# EAGLE design RoverWing-cover-V5 (EAGLE 9.2.2)
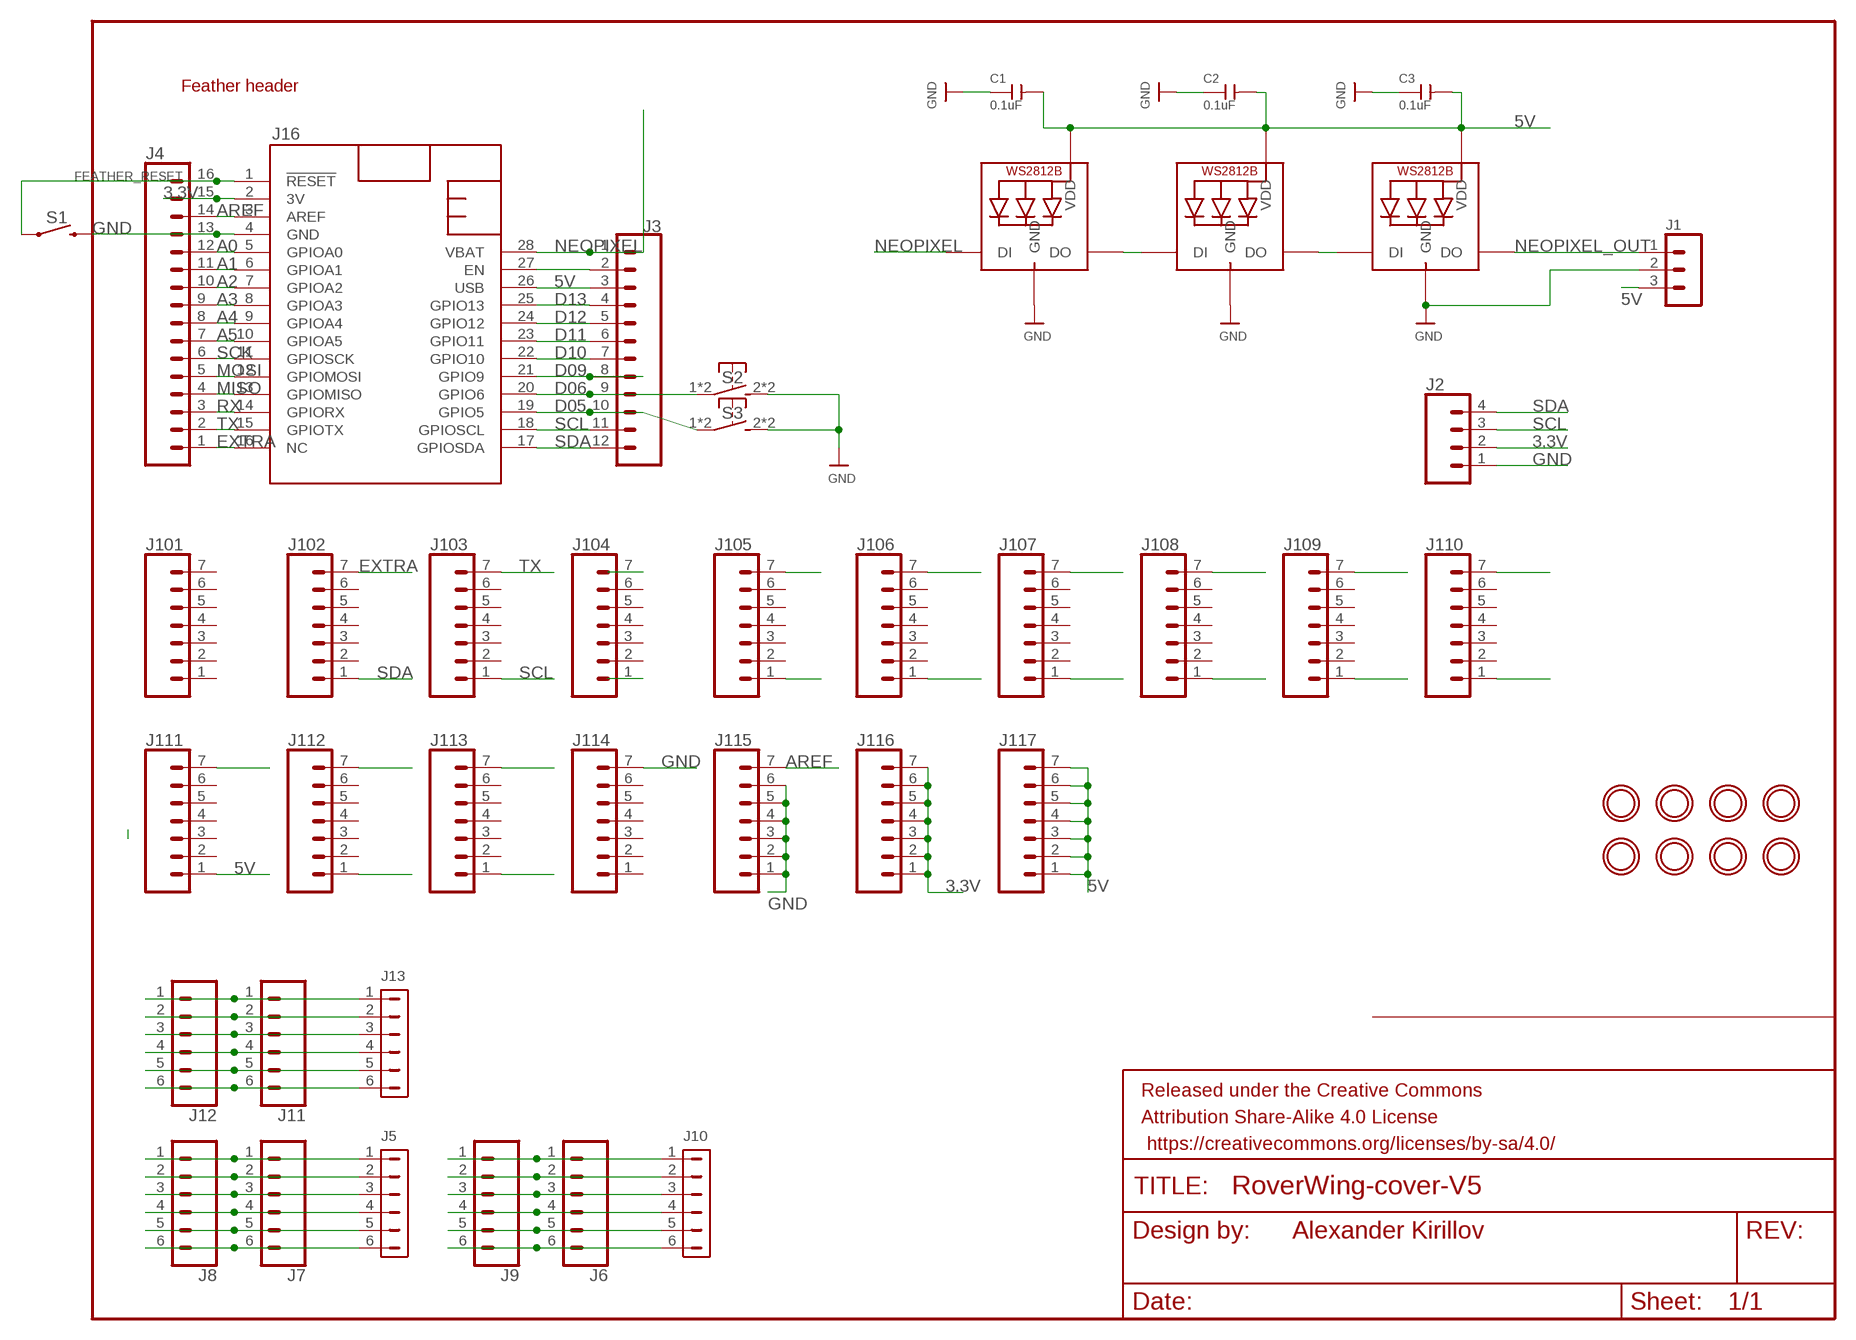
[diagram p0: schematic, sheet 1]

## Parts
C1  0.1uF  CAP-CERAMIC-SMD-0805  [C0805]
C2  0.1uF  CAP-CERAMIC-SMD-0805  [C0805]
C3  0.1uF  CAP-CERAMIC-SMD-0805  [C0805]
FRAME2  FRAME-LETTERNO_PACKAGE  [DUMMY]
J1  HEADER-PH-3PSIDEENTRY  [S3B-PH-K]
J2  CONN_04  [1X04]
J3  CONN_12NO_SILK  [1X12_NO_SILK]
J4  CONN_161X16_NO_SILK  [1X16_NO_SILK]
J5  HEADER-PH-6PSIDEENTRY  [S6B-PH-K]
J6  CONN_06NO_SILK_NO_POP  [1X06_NO_SILK]
J7  CONN_06NO_SILK_NO_POP  [1X06_NO_SILK]
J8  CONN_06NO_SILK_NO_POP  [1X06_NO_SILK]
J9  CONN_06NO_SILK_NO_POP  [1X06_NO_SILK]
J10  HEADER-PH-6PSIDEENTRY  [S6B-PH-K]
J11  CONN_06NO_SILK_NO_POP  [1X06_NO_SILK]
J12  CONN_06NO_SILK_NO_POP  [1X06_NO_SILK]
J13  HEADER-PH-6PSIDEENTRY  [S6B-PH-K]
J16  FEATHERWING_NODIM  [FEATHERWING_DIM]
J101  CONN_07NO_SILK  [1X07_NO_SILK]
J102  CONN_07NO_SILK  [1X07_NO_SILK]
J103  CONN_07NO_SILK  [1X07_NO_SILK]
J104  CONN_07NO_SILK  [1X07_NO_SILK]
J105  CONN_07NO_SILK  [1X07_NO_SILK]
J106  CONN_07NO_SILK  [1X07_NO_SILK]
J107  CONN_07NO_SILK  [1X07_NO_SILK]
J108  CONN_07NO_SILK  [1X07_NO_SILK]
J109  CONN_07NO_SILK  [1X07_NO_SILK]
J110  CONN_07NO_SILK  [1X07_NO_SILK]
J111  CONN_07NO_SILK  [1X07_NO_SILK]
J112  CONN_07NO_SILK  [1X07_NO_SILK]
J113  CONN_07NO_SILK  [1X07_NO_SILK]
J114  CONN_07NO_SILK  [1X07_NO_SILK]
J115  CONN_07NO_SILK  [1X07_NO_SILK]
J116  CONN_07NO_SILK  [1X07_NO_SILK]
J117  CONN_07NO_SILK  [1X07_NO_SILK]
LED1  WS2812B5050  [WS2812B]
LED2  WS2812B5050  [WS2812B]
LED3  WS2812B5050  [WS2812B]
S1  MOMENTARY-SWITCH-SPST-PTH-6.0MM  [TACTILE_SWITCH_PTH_6.0MM]
S2  SW-TACTILE-4.5X4.5_SMD  [TL3305]
S3  SW-TACTILE-4.5X4.5_SMD  [TL3305]
U$3  MOUNTINGHOLE3.0_NPH  [MOUNTINGHOLE_3.0_NPH]
U$4  MOUNTINGHOLE3.0_NPH  [MOUNTINGHOLE_3.0_NPH]
U$14  MOUNTINGHOLE3.0_NPH  [MOUNTINGHOLE_3.0_NPH]
U$15  MOUNTINGHOLE3.0_NPH  [MOUNTINGHOLE_3.0_NPH]
U$24  MOUNTINGHOLE3.0_NPH  [MOUNTINGHOLE_3.0_NPH]
U$25  MOUNTINGHOLE3.0_NPH  [MOUNTINGHOLE_3.0_NPH]
U$26  MOUNTINGHOLE3.0_NPH  [MOUNTINGHOLE_3.0_NPH]
U$27  MOUNTINGHOLE3.0_NPH  [MOUNTINGHOLE_3.0_NPH]

## Nets
3.3V: J2.2 J4.15 J16.2(3V) J116.1 J116.2 J116.3 J116.4 J116.5 J116.6 J116.7
5V: C1.2 C2.2 C3.2 J1.3 J3.3 J16.26(USB) J111.1 J117.1 J117.2 J117.3 J117.4 J117.5 J117.6 J117.7 LED1.1-VDD(VDD) LED2.1-VDD(VDD) LED3.1-VDD(VDD)
A0: J4.12 J16.5(GPIOA0) J113.7
A1: J4.11 J16.6(GPIOA1) J112.7
A2: J4.10 J16.7(GPIOA2) J111.7
A3: J4.9 J16.8(GPIOA3) J110.7
A4: J4.8 J16.9(GPIOA4) J109.7
A5: J4.7 J16.10(GPIOA5) J108.7
AREF: J4.14 J16.3(AREF) J115.7
D05: J3.10 J16.19(GPIO5) J104.1 S3.1 S3.4(P1)
D06: J3.9 J16.20(GPIO6) J105.1 S2.1 S2.4(P1)
D09: J3.8 J16.21(GPIO9) J106.1
D10: J3.7 J16.22(GPIO10) J107.1
D11: J3.6 J16.23(GPIO11) J108.1
D12: J3.5 J16.24(GPIO12) J109.1
D13: J3.4 J16.25(GPIO13) J110.1
EXTRA: J4.1 J16.16(NC) J102.7
FEATHER_RESET: J4.16 J16.1(!RESET) S1.1
GND: C1.1 C2.1 C3.1 J1.2 J2.1 J4.13 J16.4(GND) J114.7 J115.1 J115.2 J115.3 J115.4 J115.5 J115.6 LED1.3-GND(GND) LED2.3-GND(GND) LED3.3-GND(GND) S1.3 S2.2(S1) S2.3(S1) S3.2(S1) S3.3(S1)
MISO: J4.4 J16.13(GPIOMISO) J105.7
MOSI: J4.5 J16.12(GPIOMOSI) J106.7
N$1: LED2.2-DOUT(DO) LED3.4-DIN(DI)
N$2: J5.1 J7.1 J8.1
N$3: LED1.2-DOUT(DO) LED2.4-DIN(DI)
N$4: J5.2 J7.2 J8.2
N$5: J5.3 J7.3 J8.3
N$6: J113.1
N$7: J5.4 J7.4 J8.4
N$8: J5.5 J7.5 J8.5
N$9: J5.6 J7.6 J8.6
N$10: J6.1 J9.1 J10.1
N$11: J6.2 J9.2 J10.2
N$12: J6.3 J9.3 J10.3
N$13: J6.4 J9.4 J10.4
N$14: J6.5 J9.5 J10.5
N$15: J6.6 J9.6 J10.6
N$16: J11.1 J12.1 J13.1
N$17: J11.2 J12.2 J13.2
N$18: J11.3 J12.3 J13.3
N$19: J11.4 J12.4 J13.4
N$20: J11.5 J12.5 J13.5
N$21: J11.6 J12.6 J13.6
N$37: J3.2 J16.27(EN) J112.1
NEOPIXEL: J3.1 J16.28(VBAT) LED1.4-DIN(DI)
NEOPIXEL_OUT: J1.1 LED3.2-DOUT(DO)
RX: J4.3 J16.14(GPIORX) J104.7
SCK: J4.6 J16.11(GPIOSCK) J107.7
SCL: J2.3 J3.11 J16.18(GPIOSCL) J103.1
SDA: J2.4 J3.12 J16.17(GPIOSDA) J102.1
TX: J4.2 J16.15(GPIOTX) J103.7
Unconnected: J101.1 J101.2 J101.3 J101.4 J101.5 J101.6 J101.7 J102.2 J102.3 J102.4 J102.5 J102.6 J103.2 J103.3 J103.4 J103.5 J103.6 J104.2 J104.3 J104.4 J104.5 J104.6 J105.2 J105.3 J105.4 J105.5 J105.6 J106.2 J106.3 J106.4 J106.5 J106.6 J107.2 J107.3 J107.4 J107.5 J107.6 J108.2 J108.3 J108.4 J108.5 J108.6 J109.2 J109.3 J109.4 J109.5 J109.6 J110.2 J110.3 J110.4 J110.5 J110.6 J111.2 J111.3 J111.4 J111.5 J111.6 J112.2 J112.3 J112.4 J112.5 J112.6 J113.2 J113.3 J113.4 J113.5 J113.6 J114.1 J114.2 J114.3 J114.4 J114.5 J114.6

## Notes on the sheet
- Feather header
- Alexander Kirillov

## Library data of the parts
C1-C3 = RoverWing:CAP-CERAMIC-SMD-0805
FRAME2 = SparkFun-Aesthetics:FRAME-LETTER: Schematic Frame - Letter Standard 8.5x11 US Letter frame; DESIGNER: Nobody; VERSION: v01
J1 = RoverWing:HEADER-PH-3P: HEADER; PARTNO: S3B-PH-K-S(LF)(SN)
J2 = SparkFun-Connectors:CONN_04: Multi connection point. Often used as Generic Header-pin footprint for 0.1 inch spaced/style header connections On any of the 0.1 inch spaced packages, you can populate with these: Break Away Headers - Straight <https://www.sparkfun.com/products/116> (PRT-00116) Break Away Male Headers - Right Angle <https://www.sparkfun.com/products/553> (PRT-00553) Female Headers <https://www.sparkfun.com/products/115> (PRT-00115) Break Away Headers - Machine Pin <https://www.sparkfun.com/products/117> (PRT-00117) Break Away Female Headers - Swiss Machine Pin <https://www.sparkfun.com/products/743> (PRT-00743) For SCREWTERMINALS and SPRING TERMINALS visit here: Screw Terimnals on SparkFun.com <https://www.sparkfun.com/search/results?term=Screw+Terminals> (5mm/3.5mm/2.54mm spacing) This device is also useful as a general connection point to wire up your design to another part of your project. Our various solder wires solder well into these plated through hole pads. Hook-Up Wire - Assortment (Stranded, 22 AWG) <https://www.sparkfun.com/products/11375> (PRT-11375) Hook-Up Wire - Assortment (Solid Core, 22 AWG) <https://www.sparkfun.com/products/11367> (PRT-11367) View the entire wire category on our website here <https://www.sparkfun.com/categories/141> Special notes: Molex polarized connector foot print use with SKU : PRT-08231 with associated crimp pins and housings. 1MM SMD Version SKU: PRT-10208; PROD_ID: CONN-09696
J3 = SparkFun-Connectors:CONN_12: Multi connection point. Often used as Generic Header-pin footprint for 0.1 inch spaced/style header connections On any of the 0.1 inch spaced packages, you can populate with these: Break Away Headers - Straight <https://www.sparkfun.com/products/116> (PRT-00116) Break Away Male Headers - Right Angle <https://www.sparkfun.com/products/553> (PRT-00553) Female Headers <https://www.sparkfun.com/products/115> (PRT-00115) Break Away Headers - Machine Pin <https://www.sparkfun.com/products/117> (PRT-00117) Break Away Female Headers - Swiss Machine Pin <https://www.sparkfun.com/products/743> (PRT-00743) For SCREWTERMINALS and SPRING TERMINALS visit here: Screw Terimnals on SparkFun.com <https://www.sparkfun.com/search/results?term=Screw+Terminals> (5mm/3.5mm/2.54mm spacing) This device is also useful as a general connection point to wire up your design to another part of your project. Our various solder wires solder well into these plated through hole pads. Hook-Up Wire - Assortment (Stranded, 22 AWG) <https://www.sparkfun.com/products/11375> (PRT-11375) Hook-Up Wire - Assortment (Solid Core, 22 AWG) <https://www.sparkfun.com/products/11367> (PRT-11367) View the entire wire category on our website here <https://www.sparkfun.com/categories/141> Special notes: Molex polarized connector foot print use with SKU : PRT-08231 with associated crimp pins and housings. 1MM SMD Version SKU: PRT-10208 NOTES ON THE VARIANTS LOCK and LOCK_LONGPADS... This footprint was designed to help hold the alignment of a through-hole component (i.e. 6-pin header) while soldering it into place. You may notice that each hole has been shifted either up or down by 0.005 of an inch from it's more standard position (which is a perfectly straight line). This slight alteration caused the pins (the squares in the middle) to touch the edges of the holes. Because they are alternating, it causes a "brace" to hold the component in place. 0.005 has proven to be the perfect amount of "off-center" position when using our standard breakaway headers. Although looks a little odd when you look at the bare footprint, once you have a header in there, the alteration is very hard to notice. Also,if you push a header all the way into place, it is covered up entirely on the bottom side.
J4 = SparkFun-Connectors:CONN_16: Multi connection point. Often used as Generic Header-pin footprint for 0.1 inch spaced/style header connections On any of the 0.1 inch spaced packages, you can populate with these: Break Away Headers - Straight <https://www.sparkfun.com/products/116> (PRT-00116) Break Away Male Headers - Right Angle <https://www.sparkfun.com/products/553> (PRT-00553) Female Headers <https://www.sparkfun.com/products/115> (PRT-00115) Break Away Headers - Machine Pin <https://www.sparkfun.com/products/117> (PRT-00117) Break Away Female Headers - Swiss Machine Pin <https://www.sparkfun.com/products/743> (PRT-00743) For SCREWTERMINALS and SPRING TERMINALS visit here: Screw Terimnals on SparkFun.com <https://www.sparkfun.com/search/results?term=Screw+Terminals> (5mm/3.5mm/2.54mm spacing) This device is also useful as a general connection point to wire up your design to another part of your project. Our various solder wires solder well into these plated through hole pads. Hook-Up Wire - Assortment (Stranded, 22 AWG) <https://www.sparkfun.com/products/11375> (PRT-11375) Hook-Up Wire - Assortment (Solid Core, 22 AWG) <https://www.sparkfun.com/products/11367> (PRT-11367) View the entire wire category on our website here <https://www.sparkfun.com/categories/141> Special notes: Molex polarized connector foot print use with SKU : PRT-08231 with associated crimp pins and housings. 1MM SMD Version SKU: PRT-10208 NOTES ON THE VARIANTS LOCK and LOCK_LONGPADS... This footprint was designed to help hold the alignment of a through-hole component (i.e. 6-pin header) while soldering it into place. You may notice that each hole has been shifted either up or down by 0.005 of an inch from it's more standard position (which is a perfectly straight line). This slight alteration caused the pins (the squares in the middle) to touch the edges of the holes. Because they are alternating, it causes a "brace" to hold the component in place. 0.005 has proven to be the perfect amount of "off-center" position when using our standard breakaway headers. Although looks a little odd when you look at the bare footprint, once you have a header in there, the alteration is very hard to notice. Also,if you push a header all the way into place, it is covered up entirely on the bottom side.
J5 J10 J13 = RoverWing:HEADER-PH-6P: JST PH header, 6 pos
J6-J9 J11 J12 = SparkFun-Connectors:CONN_06: Multi connection point. Often used as Generic Header-pin footprint for 0.1 inch spaced/style header connections On any of the 0.1 inch spaced packages, you can populate with these: Break Away Headers - Straight <https://www.sparkfun.com/products/116> (PRT-00116) Break Away Male Headers - Right Angle <https://www.sparkfun.com/products/553> (PRT-00553) Female Headers <https://www.sparkfun.com/products/115> (PRT-00115) Break Away Headers - Machine Pin <https://www.sparkfun.com/products/117> (PRT-00117) Break Away Female Headers - Swiss Machine Pin <https://www.sparkfun.com/products/743> (PRT-00743) Arduino Stackable Header - 6 Pin <https://www.sparkfun.com/products/9280> (PRT-09280) For SCREWTERMINALS and SPRING TERMINALS visit here: Screw Terimnals on SparkFun.com <https://www.sparkfun.com/search/results?term=Screw+Terminals> (5mm/3.5mm/2.54mm spacing) This device is also useful as a general connection point to wire up your design to another part of your project. Our various solder wires solder well into these plated through hole pads. Hook-Up Wire - Assortment (Stranded, 22 AWG) <https://www.sparkfun.com/products/11375> (PRT-11375) Hook-Up Wire - Assortment (Solid Core, 22 AWG) <https://www.sparkfun.com/products/11367> (PRT-11367) View the entire wire category on our website here <https://www.sparkfun.com/categories/141>
J16 = RoverShield:FEATHERWING: Adafruit Feather
J101-J117 = SparkFun-Connectors:CONN_07: Multi connection point. Often used as Generic Header-pin footprint for 0.1 inch spaced/style header connections On any of the 0.1 inch spaced packages, you can populate with these: Break Away Headers - Straight <https://www.sparkfun.com/products/116> (PRT-00116) Break Away Male Headers - Right Angle <https://www.sparkfun.com/products/553> (PRT-00553) Female Headers <https://www.sparkfun.com/products/115> (PRT-00115) Break Away Headers - Machine Pin <https://www.sparkfun.com/products/117> (PRT-00117) Break Away Female Headers - Swiss Machine Pin <https://www.sparkfun.com/products/743> (PRT-00743) For SCREWTERMINALS and SPRING TERMINALS visit here: Screw Terimnals on SparkFun.com <https://www.sparkfun.com/search/results?term=Screw+Terminals> (5mm/3.5mm/2.54mm spacing) This device is also useful as a general connection point to wire up your design to another part of your project. Our various solder wires solder well into these plated through hole pads. Hook-Up Wire - Assortment (Stranded, 22 AWG) <https://www.sparkfun.com/products/11375> (PRT-11375) Hook-Up Wire - Assortment (Solid Core, 22 AWG) <https://www.sparkfun.com/products/11367> (PRT-11367) View the entire wire category on our website here <https://www.sparkfun.com/categories/141> Special notes: Molex polarized connector foot print use with SKU : PRT-08231 with associated crimp pins and housings. 1MM SMD Version SKU: PRT-10208 NOTES ON THE VARIANTS LOCK and LOCK_LONGPADS... This footprint was designed to help hold the alignment of a through-hole component (i.e. 6-pin header) while soldering it into place. You may notice that each hole has been shifted either up or down by 0.005 of an inch from it's more standard position (which is a perfectly straight line). This slight alteration caused the pins (the squares in the middle) to touch the edges of the holes. Because they are alternating, it causes a "brace" to hold the component in place. 0.005 has proven to be the perfect amount of "off-center" position when using our standard breakaway headers. Although looks a little odd when you look at the bare footprint, once you have a header in there, the alteration is very hard to notice. Also,if you push a header all the way into place, it is covered up entirely on the bottom side.
LED1-LED3 = adafruit:WS2812B
S1 = SparkFun-Switches:MOMENTARY-SWITCH-SPST: Momentary Switch (Pushbutton) - SPST Normally-open (NO) SPST momentary switches (buttons, pushbuttons). Variants PTH-12MM - 12mm square, through-hole Momentary Pushbutton Switch - 12mm Square <https://www.sparkfun.com/products/9190> (COM-09190) PTH-6.0MM, PTH-6.0MM-KIT - 6.0mm square, through-hole Mini Pushbutton Switch <https://www.sparkfun.com/products/97> (COM-00097) KIT package intended for soldering kit's - only one side of pads' copper is exposed. PTH-RIGHT-ANGLE-KIT - Right-angle, through-hole Right Angle Tactile Button <https://www.sparkfun.com/products/10791> - Used on SparkFun BigTime Watch Kit <https://www.sparkfun.com/products/11734> SMD-12MM - 12mm square, surface-mount Tactile Button - SMD (12mm) <https://www.sparkfun.com/products/12993> (COM-12993) Used on SparkFun PicoBoard <https://www.sparkfun.com/products/11888> SMD-4.5MM - 4.5mm Square Trackball Switch Used on SparkFun Blackberry Trackballer Breakout <https://www.sparkfun.com/products/13169> SMD-4.6MMX2.8MM - 4.60mm x 2.80mm, surface mount Used on SparkFun SAMD21 Mini Breakout <https://www.sparkfun.com/products/13664> SMD-5.2MM, SMD-5.2-REDUNDANT - 5.2mm square, surface-mount Mini Pushbutton Switch - SMD <https://www.sparkfun.com/products/8720> (COM-08720) Used on Arduino Pro Mini <https://www.sparkfun.com/products/11114> REDUNDANT package connects both switch circuits together SMD-6.0X3.5MM - 6.0 x 3.5mm, surface mount Momentary Reset Switch SMD <https://www.sparkfun.com/products/8229> (COM-08229) SMD-6.2MM-TALL - 6.2mm square, surface mount Tactile Button - SMD (6mm) <https://www.sparkfun.com/products/12992> Used on SparkFun Digital Sandbox <https://www.sparkfun.com/products/12651> SMD-RIGHT-ANGLE - Right-angle, surface mount Used on SparkFun Block for Intel® Edison - Arduino <https://www.sparkfun.com/products/13036>; PROD_ID: SWCH-08441; SF_SKU: COM-00097
S2 S3 = RoverWing:SW-TACTILE: Tactile Switche
U$3 U$4 U$14 U$15 U$24-U$27 = CrickitCopy:MOUNTINGHOLE: Mounting Hole For #2 screws (0.086"/2.18mm width, 0.094"/2.4mm hole) use 2.5mm

## Net classes
1 thinpower: width 0.305 mm
2 thickpower: width 0.406 mm

## Board
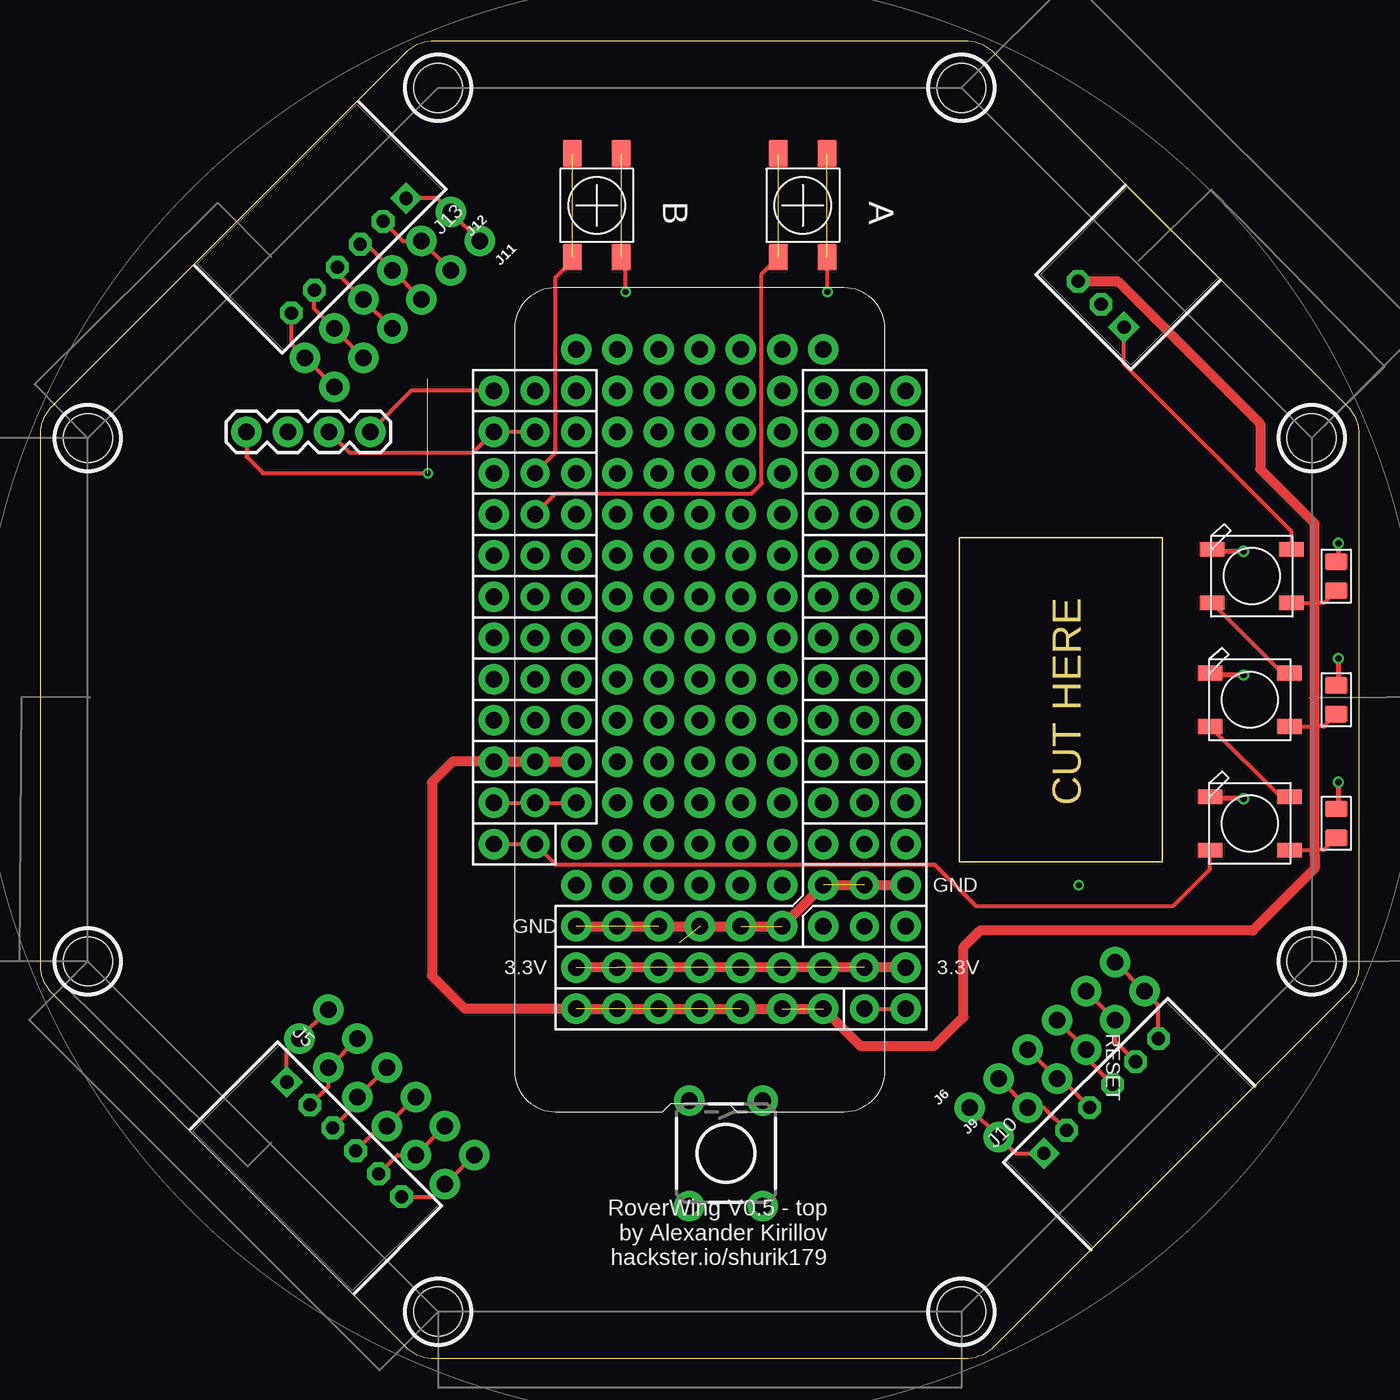
[diagram p1: board, top side]
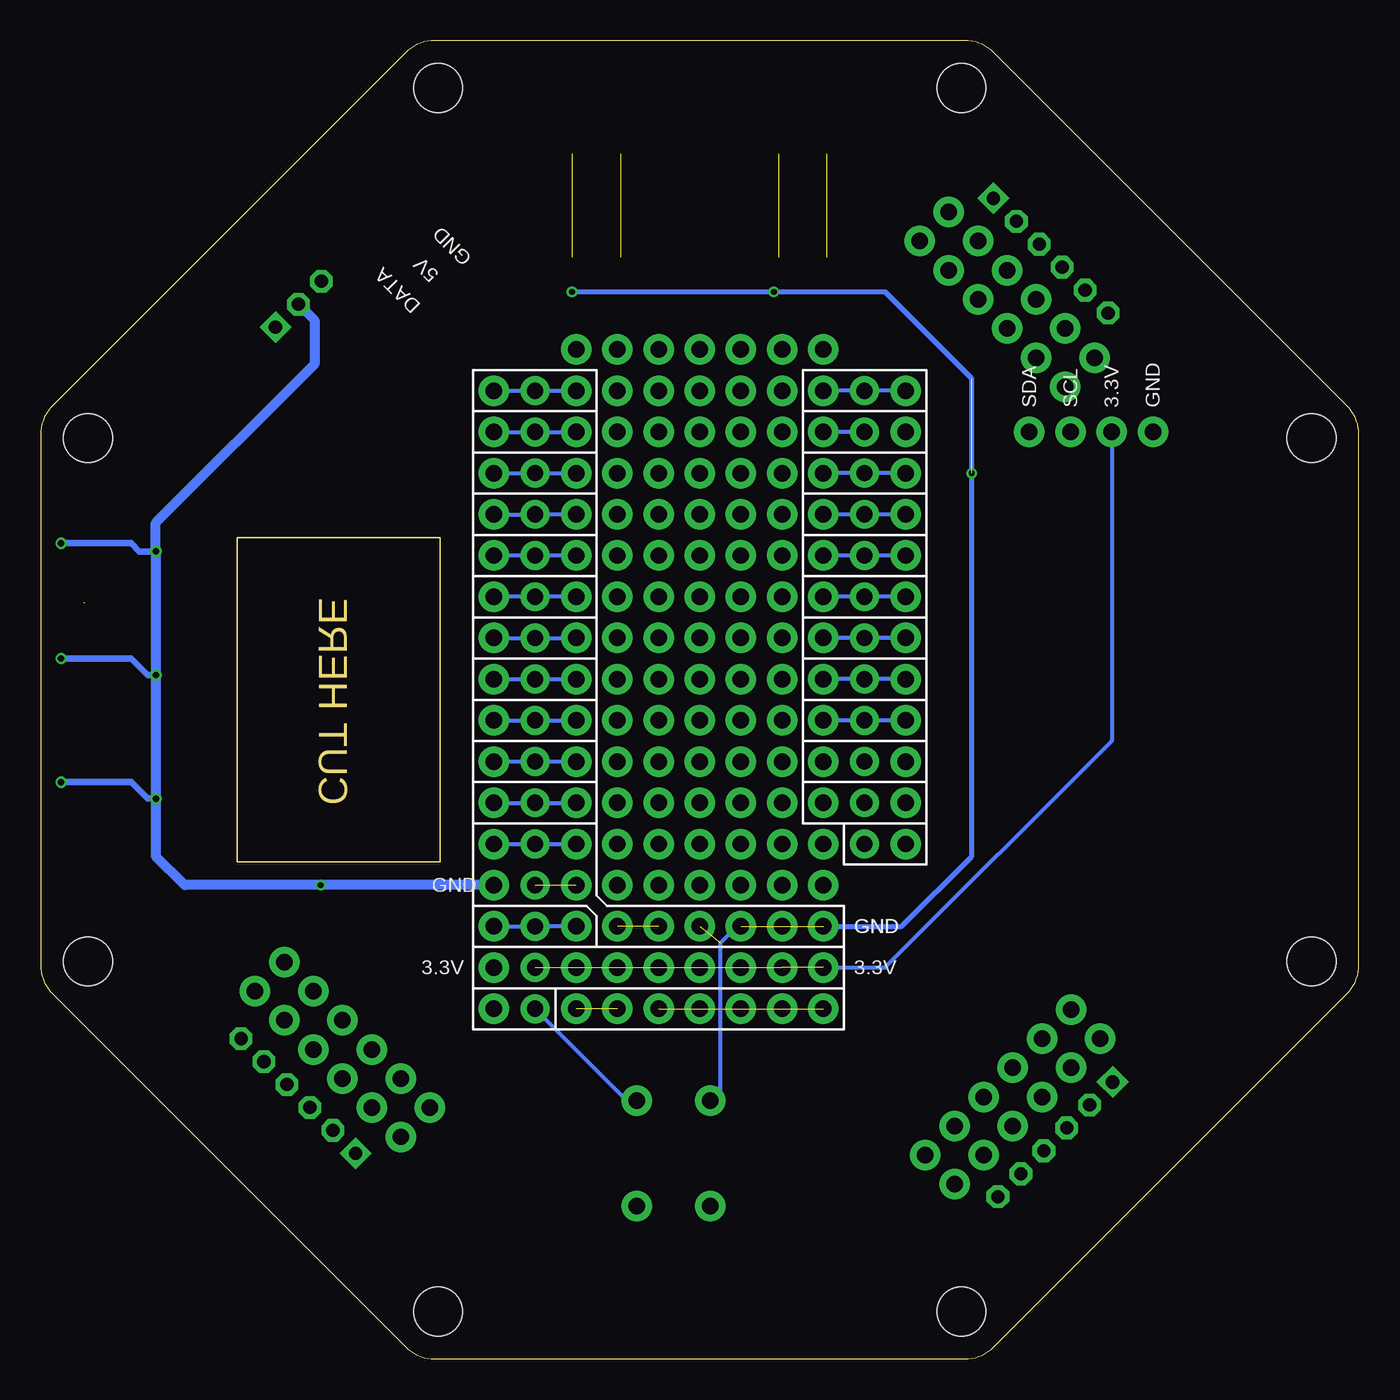
[diagram p2: board, bottom side, seen from below]

Size 81.28 x 81.28 mm. Coordinates in mm from the lower left corner, seen from the top.
Outline: 0,24.29 0,56.99 arc-45 0.74,58.78 22.5,80.54 arc-45 24.29,81.28 56.99,81.28 arc-45 58.78,80.54 80.54,58.78 arc-45 81.28,56.99 81.28,24.29 arc-45 80.54,22.5 58.78,0.74 arc-45 56.99,0 24.29,0 arc-45 22.5,0.74 0.74,22.5 arc-45 0,24.29
Outline: 56.65,50.64 69.15,50.64 69.15,30.64 56.65,30.64 56.65,50.64
Copper layers (1*16): Top 0.035mm / dielectric 1.5mm / Bottom 0.035mm
Design rules "SeeedStudio_2layer_DRU_no_angle_20140221": minimum track width 6mil, minimum drill 12mil, track to track 6mil, track to pad 6mil, pad to pad 6mil, via to via 6mil, smd to smd 0mil, copper to edge 10mil, drill to drill 10mil, minimum pad ring 10mil, minimum via ring 6mil, stop-mask expansion 2mil, vias tented up to drill 100mil, thermal gap 10mil

### Footprints (pad centres in the part's own frame; a part is rotated, then mirrored left to right if it is on the bottom)
C0805 = smd 1.397 x 1.016: 1 0,0.889; 2 0,-0.889
S3B-PH-K = drill 0.813 pad 1.397 square: 1 2,0 | drill 0.813 pad 1.397 octagon: 2 0,0; 3 -2,0
1X04 = drill 1.016 pad 1.88: 1 0,0; 2 2.54,0; 3 5.08,0; 4 7.62,0
1X12_NO_SILK = drill 1.016 pad 1.88: 1 0,0; 2 2.54,0; 3 5.08,0; 4 7.62,0; 5 10.16,0; 6 12.7,0; 7 15.24,0; 8 17.78,0; 9 20.32,0; 10 22.86,0; 11 25.4,0; 12 27.94,0
1X16_NO_SILK = drill 1.016 pad 1.88: 1 0,0; 2 2.54,0; 3 5.08,0; 4 7.62,0; 5 10.16,0; 6 12.7,0; 7 15.24,0; 8 17.78,0; 9 20.32,0; 10 22.86,0; 11 25.4,0; 12 27.94,0; 13 30.48,0; 14 33.02,0; 15 35.56,0; 16 38.1,0
S6B-PH-K = drill 0.813 pad 1.397 square: 1 5,0 | drill 0.813 pad 1.397 octagon: 2 3,0; 3 1,0; 4 -1,0; 5 -3,0; 6 -5,0
1X06_NO_SILK = drill 1.016 pad 1.88: 1 0,0; 2 2.54,0; 3 5.08,0; 4 7.62,0; 5 10.16,0; 6 12.7,0
FEATHERWING_DIM = drill 1 pad 1.778: 1 6.35,1.27; 2 8.89,1.27; 3 11.43,1.27; 4 13.97,1.27; 5 16.51,1.27; 6 19.05,1.27; 7 21.59,1.27; 8 24.13,1.27; 9 26.67,1.27; 10 29.21,1.27; 11 31.75,1.27; 12 34.29,1.27; 13 36.83,1.27; 14 39.37,1.27; 15 41.91,1.27; 16 44.45,1.27; 17 44.45,21.59; 18 41.91,21.59; 19 39.37,21.59; 20 36.83,21.59; 21 34.29,21.59; 22 31.75,21.59; 23 29.21,21.59; 24 26.67,21.59; 25 24.13,21.59; 26 21.59,21.59; 27 19.05,21.59; 28 16.51,21.59
1X07_NO_SILK = drill 1.016 pad 1.88: 1 0,0; 2 2.54,0; 3 5.08,0; 4 7.62,0; 5 10.16,0; 6 12.7,0; 7 15.24,0
WS2812B = smd 1.5 x 0.9: 1-VDD 2.45,-1.65; 2-DOUT 2.45,1.65; 3-GND -2.45,1.65; 4-DIN -2.45,-1.65
TACTILE_SWITCH_PTH_6.0MM = drill 1.016 pad 1.88: 1 -3.251,2.261; 2 3.251,2.261; 3 -3.251,-2.261; 4 3.251,-2.261
TL3305 = smd 1.6 x 1.2: 1 -3.2,1.5; 2 -3.2,-1.5; 3 3.2,-1.5; 4 3.2,1.5
MOUNTINGHOLE_3.0_NPH = hole 3: 0,0

### Placement (x,y rotation side)
C1  79.88,33.02 0 top
C2  79.88,40.64 0 top
C3  79.88,48.26 0 top
FRAME2  77.85,82.17 0 top
J1  65.38,65.02 315 top
J2  12.7,57.15 0 top
J3  27.94,31.75 90 top
J4  53.34,59.69 270 top
J5  18.72,13.54 135 top
J6  57.28,15.49 45 top
J7  17.75,21.54 315 top
J8  15.95,19.75 315 top
J9  59.07,13.69 45 top
J10  65.38,16.21 225 top
J11  27.08,68.91 225 top
J12  25.29,70.71 225 top
J13  19,68.02 45 top
J16  52.07,15.24 90 top
J101  33.02,62.23 0 top
J102  33.02,59.69 0 top
J103  33.02,57.15 0 top
J104  33.02,54.61 0 top
J105  33.02,52.07 0 top
J106  33.02,49.53 0 top
J107  33.02,46.99 0 top
J108  33.02,44.45 0 top
J109  33.02,41.91 0 top
J110  33.02,39.37 0 top
J111  33.02,36.83 0 top
J112  33.02,34.29 0 top
J113  33.02,31.75 0 top
J114  33.02,29.21 0 top
J115  33.02,26.67 0 top
J116  33.02,24.13 0 top
J117  33.02,21.59 0 top
LED1  74.55,33.02 0 top
LED2  74.55,40.64 0 top
LED3  74.68,48.26 0 top
S1  42.25,12.69 270 top
S2  46.99,71.12 90 top
S3  34.29,71.12 90 top
U$3  24.51,2.92 0 top
U$4  56.77,2.92 0 top
U$14  2.92,24.51 0 top
U$15  2.92,56.77 0 top
U$24  78.36,24.51 0 top
U$25  78.36,56.77 0 top
U$26  24.51,78.36 0 top
U$27  56.77,78.36 0 top

### Tracks (layer width: path | path; a pad name or v marks a point on that pad's centre or on a via)
3.3V  (7 unrouted)
  Top 0.61: J4.15 J116.1
  Bottom 0.254: J116.1 29.21,24.13 15.24,38.1 J2.2
5V  (6 unrouted)
  Top 0.254: LED1.1-VDD 78.29,31.37 78.55,31.12 | C1.2 79.12,31.37 78.55,31.37 | LED2.1-VDD 78.29,38.99 78.55,38.73 | C2.2 79.12,38.99 78.55,38.99 | LED3.1-VDD 78.61,46.61 | C3.2 79.12,46.61 78.55,46.61
  Top 0.406: 78.61,46.61 | LED2.1-VDD
  Top 0.61: J111.1 J16.26 J3.3 25.4,36.83 24.13,35.56 24.13,23.62 26.16,21.59 J117.1 J117.7 50.55,19.3 55.12,19.3 56.9,21.08 56.9,25.4 57.91,26.42 74.74,26.42 78.55,30.23 78.55,31.12 78.55,31.37 78.55,38.73 78.55,38.99 78.55,46.61 78.55,51.5 75.18,54.86 75.18,57.66 66.4,66.44 J1.3
A0
  Bottom 0.254: J4.12 J16.5 J113.7
A1
  Bottom 0.254: J4.11 J16.6 J112.7
A2
  Bottom 0.254: J4.10 J16.7 J111.7
A3
  Bottom 0.254: J4.9 J16.8 J110.7
A4
  Bottom 0.254: J4.8 J16.9 J109.7
A5
  Bottom 0.254: J4.7 J16.10 J108.7
AREF
  Bottom 0.254: J4.14 J16.3 J115.7
D05  (1 unrouted)
  Top 0.254: J16.19 31.75,55.88 31.75,66.67 32.79,67.72 S3.1
  Bottom 0.254: J3.10 J16.19 J104.1
D06  (1 unrouted)
  Top 0.254: J16.20 31.75,53.34 43.81,53.34 44.45,53.98 44.45,66.88 S2.1
  Bottom 0.254: J3.9 J16.20 J105.1
D09
  Bottom 0.254: J3.8 J16.21 J106.1
D10
  Bottom 0.254: J3.7 J16.22 J107.1
D11
  Bottom 0.254: J3.6 J16.23 J108.1
D12
  Bottom 0.254: J3.5 J16.24 J109.1
D13
  Bottom 0.254: J3.4 J16.25 J110.1
EXTRA
  Bottom 0.254: J102.7 J16.16 J4.1
FEATHER_RESET
  Top 0.254: J16.1 J4.16 53.51,21.43
  Bottom 0.254: J16.1 45.15,15.94 S1.1
GND  (via drill 0.35, 0.39)  (8 unrouted)
  Top 0.254: 36.15,67.56 36.07,67.64 | 36.07,67.64 S3.2 | 48.85,67.56 48.55,67.86 | 48.55,67.86 S2.2 | v36.07,65.79 36.07,67.64 | v48.51,65.79 48.51,67.82 48.55,67.86 | J2.1 12.7,55.63 13.72,54.61 v23.88,54.61
  Top 0.305: v74.17,34.54 72.22,34.54 LED1.3-GND | v74.17,42.16 72.22,42.16 LED2.3-GND | v74.17,49.78 72.35,49.78 LED3.3-GND | v80.01,50.29 80.01,49.28 C3.1 | v80.01,43.18 80.01,41.66 C2.1 | v80.01,35.56 80.01,34.04 C1.1
  Top 0.61: J115.1 J115.6 J114.7 J4.13
  Bottom 0.254: S1.3 39.37,16.56 39.37,25.65 38.35,26.67 J115.3
  Bottom 0.305: J115.1 28.19,26.67 23.88,30.99 v23.88,54.61 23.88,60.45 29.21,65.79 v36.07,65.79 v48.51,65.79
  Bottom 0.406: v74.17,49.78 75.18,49.78 75.69,50.29 v80.01,50.29 | v74.17,42.16 74.68,42.16 75.69,43.18 v80.01,43.18 | v74.17,34.54 74.68,34.54 75.69,35.56 v80.01,35.56
  Bottom 0.61: J4.13 v64.01,29.21 72.39,29.21 74.17,30.99 v74.17,34.54 v74.17,42.16 v74.17,49.78 74.17,51.56 64.39,61.34 64.39,64.03 J1.2
MISO
  Bottom 0.254: J105.7 J16.13 J4.4
MOSI
  Bottom 0.254: J106.7 J16.12 J4.5
N$1
  Top 0.254: LED2.2-DOUT 76.55,42.29 LED3.4-DIN
N$2
  Top 0.254: J5.1 15.19,18.98 J8.1 J7.1 | J7.1
N$3
  Top 0.254: LED1.2-DOUT 76.42,34.67 LED2.4-DIN
N$4
  Top 0.254: J7.2 J8.2 | J8.2 | J5.2 17.75,16.81 J8.2
N$5
  Top 0.254: J5.3 19.55,15.77 J8.3 J7.3 | J7.3
N$7
  Top 0.254: J5.4 20.96,14.36 J8.4 J7.4 | J7.4
N$8
  Top 0.254: J5.5 21.99,12.56 J8.5 J7.5 | J7.5
N$9
  Top 0.254: J5.6 24.17,10 J8.6 J7.6 | J7.6
N$10
  Top 0.254: J6.1 J9.1 | J9.1 | J9.1 60.09,12.68 J10.1
N$11
  Top 0.254: J10.2 61.86,15.49 J9.2 J6.2 | J6.2
N$12
  Top 0.254: J10.3 62.9,17.29 J9.3 J6.3 | J6.3
N$13
  Top 0.254: J10.4 64.46,18.55 J9.4 J6.4 | J6.4
N$14
  Top 0.254: J10.5 66.26,19.58 J9.5 | J9.5 | J9.5 J6.5
N$15
  Top 0.254: J10.6 68.92,21.81 J9.6 | J9.6 | J9.6 J6.6
N$16
  Top 0.254: J11.1 J12.1 24.45,71.55 J13.1
N$17
  Top 0.254: J13.2 22.35,68.91 J12.2 J11.2
N$18
  Top 0.254: J11.3 J12.3 20.09,68.72 J13.3
N$19
  Top 0.254: J11.4 J12.4 18.29,66.93 J13.4
N$20
  Top 0.254: J11.5 J12.5 16.88,64.75 J13.5
N$21
  Top 0.254: J11.6 J12.6 15.47,62.57 J13.6
N$37
  Top 0.254: J3.2 J16.27 J112.1
NEOPIXEL
  Top 0.254: J3.1 J16.28 31.75,30.48 55.12,30.48 57.66,27.94 69.85,27.94 72.1,30.19 LED1.4-DIN
NEOPIXEL_OUT
  Top 0.254: 76.87,50.16 LED3.2-DOUT 77.13,51 66.8,61.32 J1.1
RX
  Bottom 0.254: J4.3 J16.14 J104.7
SCK
  Bottom 0.254: J107.7 J16.11 J4.6
SCL
  Top 0.254: J16.18 J3.11 26.67,55.88 19.05,55.88 J2.3
  Bottom 0.254: J16.18 J103.1
SDA
  Top 0.254: J3.12 22.86,59.69 J2.4
  Bottom 0.254: J3.12 J16.17 J102.1
TX
  Bottom 0.254: J4.2 J16.15 J103.7

### Text on the board
Dimension: CUT HERE
tNames: B | A | GND | GND | 3.3V | 3.3V | RESET | RoverWing V0.5 - top / by Alexander Kirillov / hackster.io/shurik179
bNames: GND | 5V | DATA | GND | 3.3V | SCL | SDA | GND | GND | GND | 3.3V | 3.3V